# EAGLE design PR9019 (EAGLE 6.6.0)
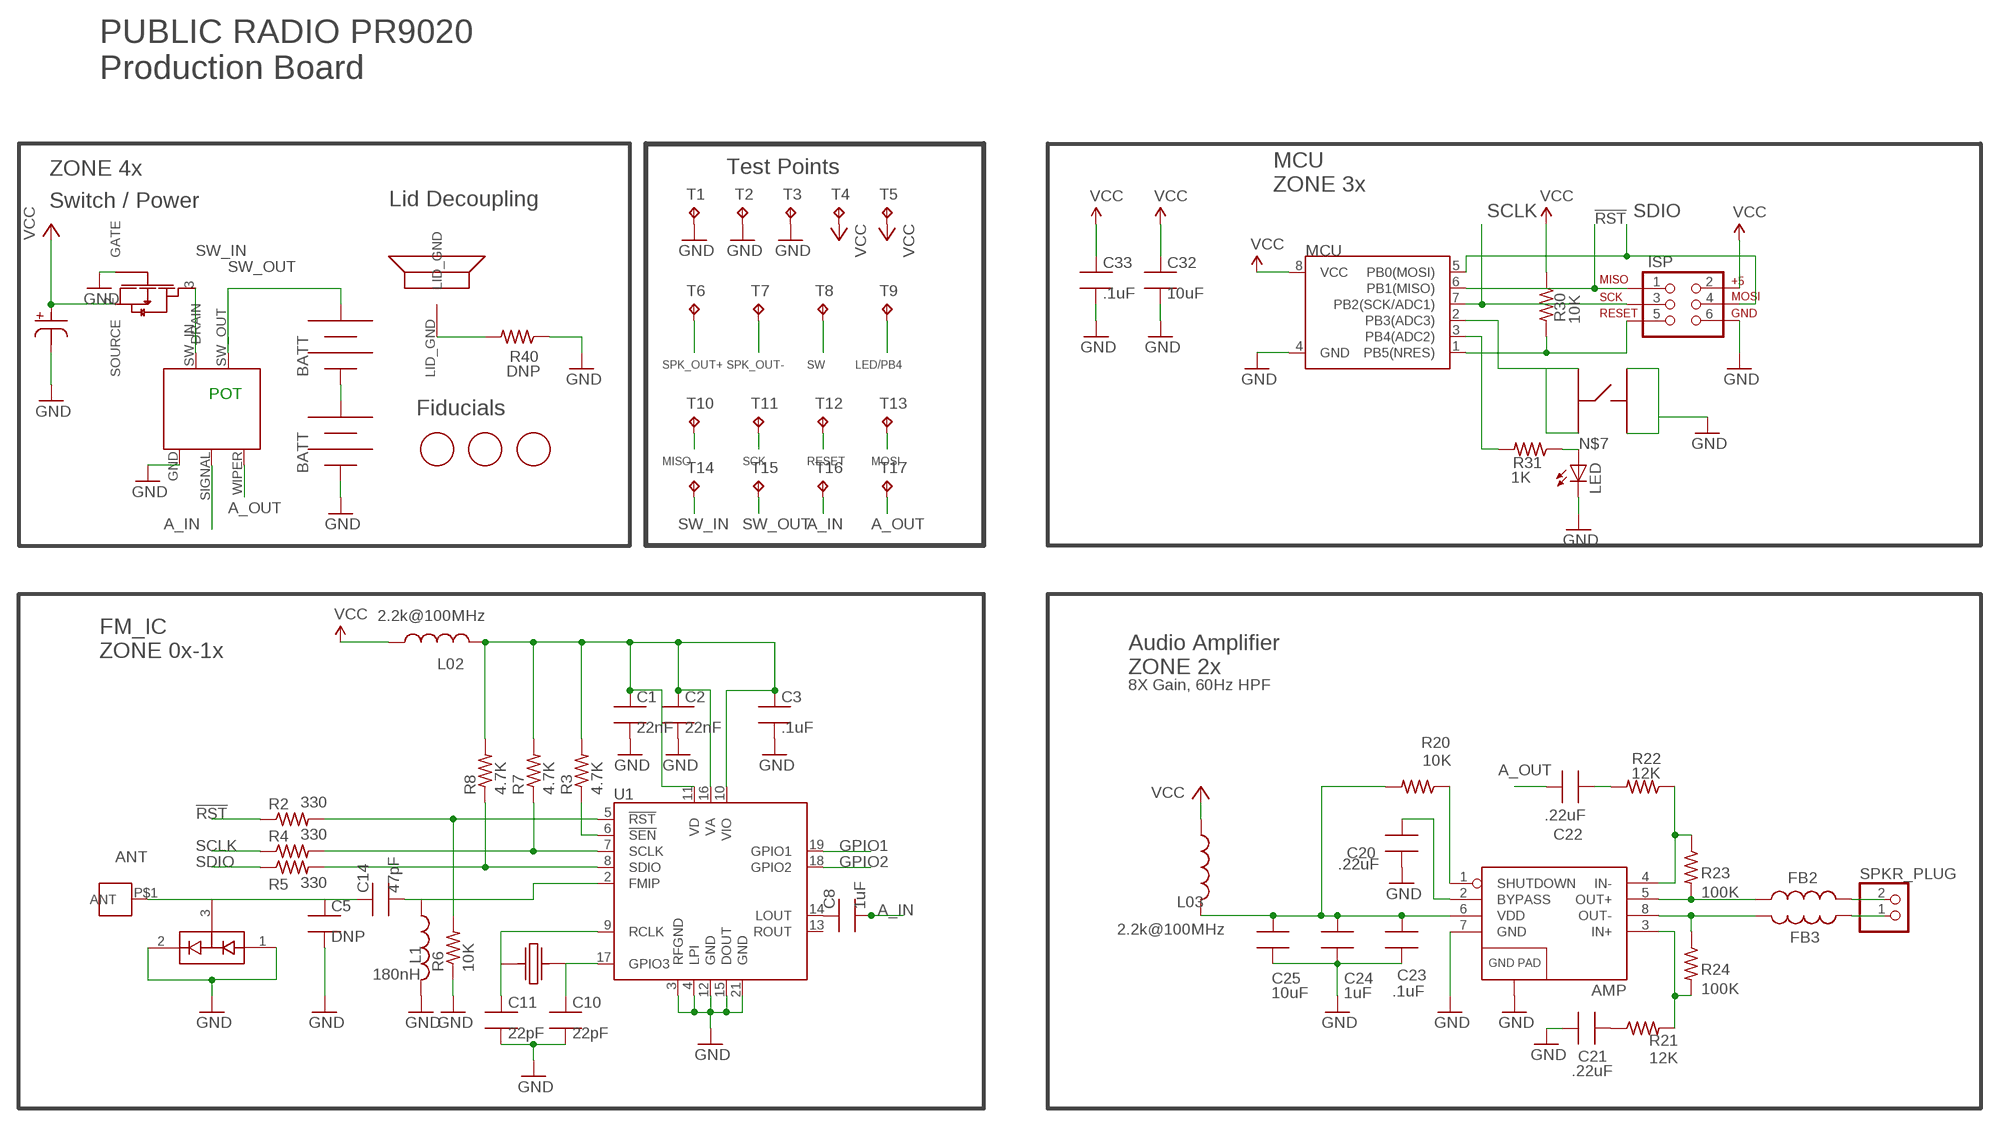
[diagram p0: schematic, sheet 1]

## Parts
AMP  TPA6203A1  [8-MSOP]
ANT_MOUNT  DNP  M3_SCREW_POST  [M3_BOLT_HOLE]
C1  22nF  C_SMT_0603_CPL  [0603_CPL]
C2  22nF  C_SMT_0603_CPL  [0603_CPL]
C3  .1uF  C_SMT_0603_CPL  [0603_CPL]
C5  DNP  C_SMT_0603_CPL  [0603_CPL]
C8  1uF  C_SMT_0603_CPL  [0603_CPL]
C10  22pF  C_SMT_0603_CPL  [0603_CPL]
C11  22pF  C_SMT_0603_CPL  [0603_CPL]
C14  47pF  C_SMT_0603_CPL  [0603_CPL]
C20  .22uF  C_SMT_0603_CPL  [0603_CPL]
C21  .22uF  C_SMT_0603_CPL  [0603_CPL]
C22  .22uF  C_SMT_0603_CPL  [0603_CPL]
C23  .1uF  C_SMT_0603_CPL  [0603_CPL]
C24  1uF  C_SMT_0603_CPL  [0603_CPL]
C25  10uF  C_SMT_0603_CPL  [0603_CPL]
C32  10uF  C_SMT_0603_CPL  [0603_CPL]
C33  .1uF  C_SMT_0603_CPL  [0603_CPL]
C40  220uF  NICHICON_SERIESUD  [NICHICON_UD_63]
D1  BAV99  [SOT23_CPL]
FB2  L_SMT_0805_ADAFRUIT  [0805_ADAFRUIT]
FB3  L_SMT_0805_ADAFRUIT  [0805_ADAFRUIT]
FET1  AO3435  [SOT23_CPL]
ISP  AVR_SPI_PRG_6NS  [2X3-NS]
JP5  BK-92_MPD_AA_BATT_CLIP  [BK92_AA_BATT]
JP6  BK-92_MPD_AA_BATT_CLIP  [BK92_AA_BATT]
L1  180nH  L_SMT_0805_ADAFRUIT  [0805_ADAFRUIT]
L02  2.2k@100MHz  L_SMT_0603_CPL  [0603_CPL]
L03  2.2k@100MHz  L_SMT_0603_CPL  [0603_CPL]
LED  LEDCHIPLED_0805  [CHIPLED_0805]
MARK1  FIDUCIAL  [FIDUCIAL_1MM]
MARK2  FIDUCIAL  [FIDUCIAL_1MM]
MARK3  FIDUCIAL  [FIDUCIAL_1MM]
MCU  ATTINY45TINY45-20-SMT  [8-SOIC]
R1  RV170SF_TAIWANA_POT_SW  [RV170SF_SW_POT]
R2  330  R_SMT_R0603_CPL  [0603_CPL]
R3  4.7K  R_SMT_R0603_CPL  [0603_CPL]
R4  330  R_SMT_R0603_CPL  [0603_CPL]
R5  330  R_SMT_R0603_CPL  [0603_CPL]
R6  10K  R_SMT_R0603_CPL  [0603_CPL]
R7  4.7K  R_SMT_R0603_CPL  [0603_CPL]
R8  4.7K  R_SMT_R0603_CPL  [0603_CPL]
R20  10K  R_SMT_R0603_CPL  [0603_CPL]
R21  12K  R_SMT_R0603_CPL  [0603_CPL]
R22  12K  R_SMT_R0603_CPL  [0603_CPL]
R23  100K  R_SMT_R0603_CPL  [0603_CPL]
R24  100K  R_SMT_R0603_CPL  [0603_CPL]
R30  10K  R_SMT_R0603_CPL  [0603_CPL]
R31  1K  R_SMT_R0603_CPL  [0603_CPL]
R40  DNP  R_SMT_R0603_CPL  [0603_CPL]
SPKR_PLACE  DNP  PR2023_SPKR  [PR2023_SPKR_PLACE]
SPKR_PLUG  JST_2PIN-SMT-RA  [JST-B2B-PH-SM4-TB]
SW1  C&K_PTS645  [C&K_PTS645_SMT]
T1  TPTP20R  [TP20R]
T2  TPTP20R  [TP20R]
T3  TPTP20R  [TP20R]
T4  TPTP20R  [TP20R]
T5  TPTP20R  [TP20R]
T6  TPTP20R  [TP20R]
T7  TPTP20R  [TP20R]
T8  TPTP20R  [TP20R]
T9  TPTP20R  [TP20R]
T10  TPTP20R  [TP20R]
T11  TPTP20R  [TP20R]
T12  TPTP20R  [TP20R]
T13  TPTP20R  [TP20R]
T14  TPTP20R  [TP20R]
T15  TPTP20R  [TP20R]
T16  TPTP20R  [TP20R]
T17  TPTP20R  [TP20R]
U1  SI4702-C19-GMR  [SI470X_20_QFN]
X1  ABS25XTAL  [4-SOJ]

## Nets
3.3V: C1.1 C2.1 C3.1 L02.2 R3.2 R7.2 R8.2 U1.10(VIO) U1.11(VD) U1.16(VA)
!RST: ISP.1 MCU.6(PB1(MISO)) R2.1 T10.TP
!RST-L: R2.2 R6.2 U1.5(!RST)
!SEN-L: R3.1 U1.6(!SEN)
A_IN: C8.2 R1.SIGNAL T16.TP
A_OUT: C22.2 R1.WIPER T17.TP
ANT [antenna]: ANT_MOUNT.P$1(ANT) C5.1 C14.1 D1.3(COM)
GND: AMP.7(GND) AMP.9(GND) C1.2 C2.2 C3.2 C5.2 C10.2 C11.2 C20.1 C21.1 C23.2 C24.2 C25.2 C32.2 C33.2 C40.P$2 D1.1(A1) D1.2(C2) FET1.1(GATE) ISP.6 JP6.NEG JP6.NEG@2(NEG) L1.2 LED.C MCU.4(GND) R1.GND R6.1 R40.1 SW1.P$1 SW1.P$2 T1.TP T2.TP T3.TP U1.3(RFGND) U1.4(LPI) U1.12(GND) U1.15(DOUT) U1.21(GND)
GPIO1: U1.19(GPIO1)
GPIO2: U1.18(GPIO2)
LED/PB4: MCU.3(PB4(ADC2)) R31.2 T9.TP
N$1: C11.1 U1.9(RCLK) X1.P$1
N$2: AMP.6(VDD) C23.1 C24.1 C25.1 L03.2 R20.2
N$3: C22.1 R22.2
N$4: AMP.5(OUT+) FB2.1 R23.2
N$5: AMP.3(IN+) R21.2 R24.2
N$7: LED.A R31.1
N$8: R40.2 SPKR_PLACE.LID_GND
N$9: C8.1 U1.14(LOUT)
N$10: C10.1 U1.17(GPIO3) X1.P$4
N$11: AMP.8(OUT-) FB3.2 R24.1
N$12: AMP.2(BYPASS) C20.2
N$13: JP5.NEG JP5.NEG@2(NEG) JP6.POS JP6.POS@2(POS)
N$14: AMP.4(IN-) R22.1 R23.1
N$16 [antenna]: C14.2 L1.1 U1.2(FMIP)
N$20: AMP.1(SHUTDOWN) R20.1
N$23: C21.2 R21.1
RESET: ISP.5 MCU.1(PB5(NRES)) R30.2 T12.TP
SCLK: ISP.3 MCU.7(PB2(SCK/ADC1)) R4.1 T11.TP
SCLK-L: R4.2 R7.1 U1.7(SCLK)
SDIO: ISP.4 MCU.5(PB0(MOSI)) R5.1 T13.TP
SDIO-L: R5.2 R8.1 U1.8(SDIO)
SPK_OUT+: FB2.2 SPKR_PLUG.2 T6.TP
SPK_OUT-: FB3.1 SPKR_PLUG.1 T7.TP
SW: MCU.2(PB3(ADC3)) SW1.P$3 SW1.P$4 T8.TP
SW_IN: FET1.3(DRAIN) R1.SW_IN T14.TP
SW_OUT: JP5.POS JP5.POS@2(POS) R1.SW_OUT T15.TP
VCC: C32.1 C33.1 C40.P$1 FET1.2(SOURCE) ISP.2 L02.1 L03.1 MCU.8(VCC) R30.1 T4.TP T5.TP
Unconnected: U1.13(ROUT)

## Notes on the sheet
- PUBLIC RADIO PR9020
  Production Board
- ZONE 4x | Test Points
- MCU
  ZONE 3x
- Switch / Power | Lid Decoupling
- POT
- Fiducials
- MISO | SCK | RESET | MOSI
- FM_IC
  ZONE 0x-1x
- Audio Amplifier 
  ZONE 2x
- 8X Gain, 60Hz HPF

## Library data of the parts
AMP = PR_Parts_Library:TPA6203A1: IC AMP AUDIO PWR 1.25W AB 8MSOP; MFG_PN: TPA6203A1DGNR
ANT_MOUNT = PR_Parts_Library:M3_SCREW_POST: Antenna mounting hole for M3 screw.; MFG_PN: DNP
C1 C2 = PR_Parts_Library:C_SMT: SMT capacitor; MFG_PN: CL10B223KB8NNNC; TOL: 10%; VOLTAGE: 16V
C3 C23 C33 = PR_Parts_Library:C_SMT: SMT capacitor; MFG_PN: CL10B104KB8SFNC; TOL: 10%; VOLTAGE: 16V
C5 = PR_Parts_Library:C_SMT: SMT capacitor; MFG_PN: DNP; TOL: 2%; VOLTAGE: 50V
C8 C24 = PR_Parts_Library:C_SMT: SMT capacitor; MFG_PN: CL10B105KP8NNNC; TOL: 10%; VOLTAGE: 10V
C10 C11 = PR_Parts_Library:C_SMT: SMT capacitor; MFG_PN: C1608C0G1H220J080AA; TOL: 5%; VOLTAGE: 50V
C14 = PR_Parts_Library:C_SMT: SMT capacitor; MFG_PN: CL10C470JB8NCNC; TOL: 5%; VOLTAGE: 50V
C20-C22 = PR_Parts_Library:C_SMT: SMT capacitor; MFG_PN: C1608X7R1C224K080AC; TOL: 10%; VOLTAGE: 16V
C25 C32 = PR_Parts_Library:C_SMT: SMT capacitor; MFG_PN: CL10A106MQ8NNNC; TOL: 20%; VOLTAGE: 6.3V
C40 = PR_Parts_Library:NICHICON_SERIESUD: Nichicon UD Series 220uf Cap MFG# UUD1C221MCL1GS; MFG_PN: UUD1C221MCL1GS; TOL: 20%; VOLTAGE: 16V
D1 = PR_Parts_Library:BAV99: DIODE ARRAY GP 100V 215MA SOT23; MFG_PN: BAV99,215
FB2 FB3 = PR_Parts_Library:L_SMT: SMT inductor; CURRENT: 2A; DCR: 45m; MFG_PN: HI0805R800R-10
FET1 = PR_Parts_Library:AO3435: MOSFET P-CH 20V 2.9A SOT23; MFG_PN: AO3435
ISP = PR_Parts_Library:AVR_SPI_PRG_6: DIL VERTICAL PC TAIL PIN HEADER; MFG_PN: M20-9980346
JP5 JP6 = PR_Parts_Library:BK-92_MPD_AA_BATT_CLIP: Thru hole AA battery clip pair.; MFG_PN: 2 of BK92 - supplied by CL Labs
L1 = PR_Parts_Library:L_SMT: SMT inductor; CURRENT: 400mA; DCR: 640m; MFG_PN: AISC-0805-R18J-T; TOL: 5%
L02 L03 = PR_Parts_Library:L_SMT: SMT inductor; CURRENT: 150mA; DCR: 2.3; MFG_PN: HZ0603A222R-10
LED = adafruit:LED: LED OSRAM: - CHIPLED LG R971, LG N971, LY N971, LG Q971, LY Q971, LO R971, LY R971 LH N974, LH R974 LS Q976, LO Q976, LY Q976 LO Q996 - Hyper CHIPLED LW Q18S LB Q993, LB Q99A, LB R99A - SideLED LS A670, LO A670, LY A670, LG A670, LP A670 LB A673, LV A673, LT A673, LW A673 LH A674 LY A675 LS A676, LA A676, LO A676, LY A676, LW A676 LS A679, LY A679, LG A679 - Hyper Micro SIDELED® LS Y876, LA Y876, LO Y876, LY Y876 LT Y87S - SmartLED LW L88C, LW L88S LB L89C, LB L89S, LG L890 LS L89K, LO L89K, LY L89K LS L896, LA L896, LO L896, LY L896 - TOPLED LS T670, LO T670, LY T670, LG T670, LP T670 LSG T670, LSP T670, LSY T670, LOP T670, LYG T670 LG T671, LOG T671, LSG T671 LB T673, LV T673, LT T673, LW T673 LH T674 LS T676, LA T676, LO T676, LY T676, LB T676, LH T676, LSB T676, LW T676 LB T67C, LV T67C, LT T67C, LS T67K, LO T67K, LY T67K, LW E67C LS E67B, LA E67B, LO E67B, LY E67B, LB E67C, LV E67C, LT E67C LW T67C LS T679, LY T679, LG T679 LS T770, LO T770, LY T770, LG T770, LP T770 LB T773, LV T773, LT T773, LW T773 LH T774 LS E675, LA E675, LY E675, LS T675 LS T776, LA T776, LO T776, LY T776, LB T776 LHGB T686 LT T68C, LB T68C - Hyper Mini TOPLED® LB M676 - Mini TOPLED Santana® LG M470 LS M47K, LO M47K, LY M47K Source: http://www.osram.convergy.de/; MFG_PN: LY R976-PS-36
MARK1-MARK3 = PR_Parts_Library:FIDUCIAL: 1mm fiducial.; MFG_PN: DNP
MCU = PR_Parts_Library:ATTINY45: Atmel 8-pin 2/4/8kB flash uC; MFG_PN: ATTINY45-20SUR
R1 = PR_Parts_Library:RV170SF_TAIWANA_POT_SW: Thru hole switched potentiometer.; MFG_PN: RV170SF-43-20F-A10K - supplied by CL Labs
R2 R4 R5 = PR_Parts_Library:R_SMT: SMT resistor; MFG_PN: MCR03ERTJ331; POWER: 1/10W; TOL: 5%
R3 R7 R8 = PR_Parts_Library:R_SMT: SMT resistor; MFG_PN: ERJ-3EKF4701V; POWER: 1/10W; TOL: 1%
R6 R20 R30 = PR_Parts_Library:R_SMT: SMT resistor; MFG_PN: ERJ-3GEYJ103V; POWER: 1/10W; TOL: 5%
R21 R22 = PR_Parts_Library:R_SMT: SMT resistor; MFG_PN: RC0603FR-0712KL; POWER: 1/10W; TOL: 1%
R23 R24 = PR_Parts_Library:R_SMT: SMT resistor; MFG_PN: ERJ-3EKF1003V; POWER: 1/10W; TOL: 1%
R31 = PR_Parts_Library:R_SMT: SMT resistor; MFG_PN: ERJ-3EKF1001V; POWER: 1/10W; TOL: 1%
R40 = PR_Parts_Library:R_SMT: SMT resistor; MFG_PN: ERJ-3GEY0R00V
SPKR_PLACE = PR_Parts_Library:PR2023_SPKR: Speaker placement for PR2023.; MFG_PN: DNP
SPKR_PLUG = PR_Parts_Library:JST_2PIN: JST 2-pin connector; MFG_PN: B2B-PH-SM4-TB(LF)(SN)
SW1 = PR_Parts_Library:C&K_PTS645: SWITCH TACTILE SPST-NO 0.05A 12V; MFG_PN: PTS645SM43SMTR92 LFS
T1-T17 = PR_Parts_Library:TP: Test pad; MFG_PN: DNP
U1 = PR_Parts_Library:SI4702-C19-GMR: IC FM RADIO TUNER 20-QFN; MFG_PN: Si4702 C19 GM - supplied by CL Labs
X1 = PR_Parts_Library:ABS25XTAL: 4PIN 32.768 Xtal MFG# ABS25-32.768KHZ-T; MFG_PN: ABS25-32.768KHZ-T

## Net classes
1 antenna: clearance 1.27 mm

## Board
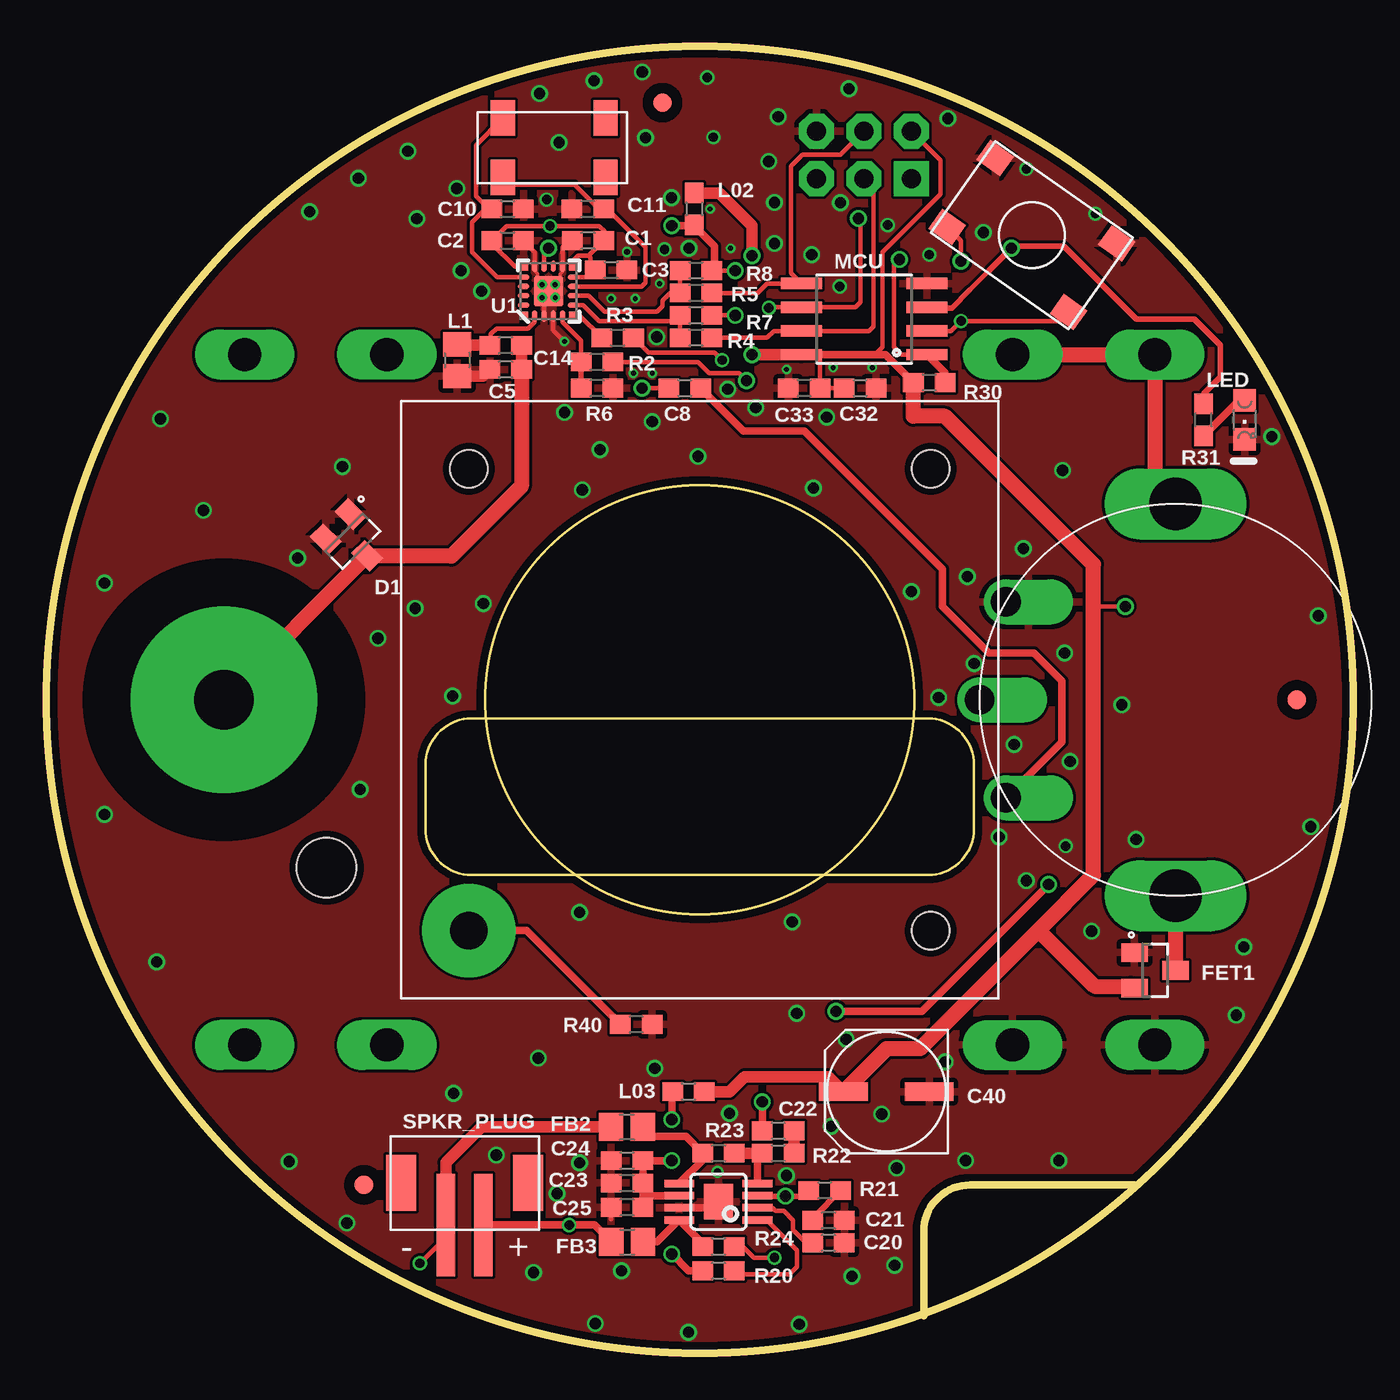
[diagram p1: board, top side]
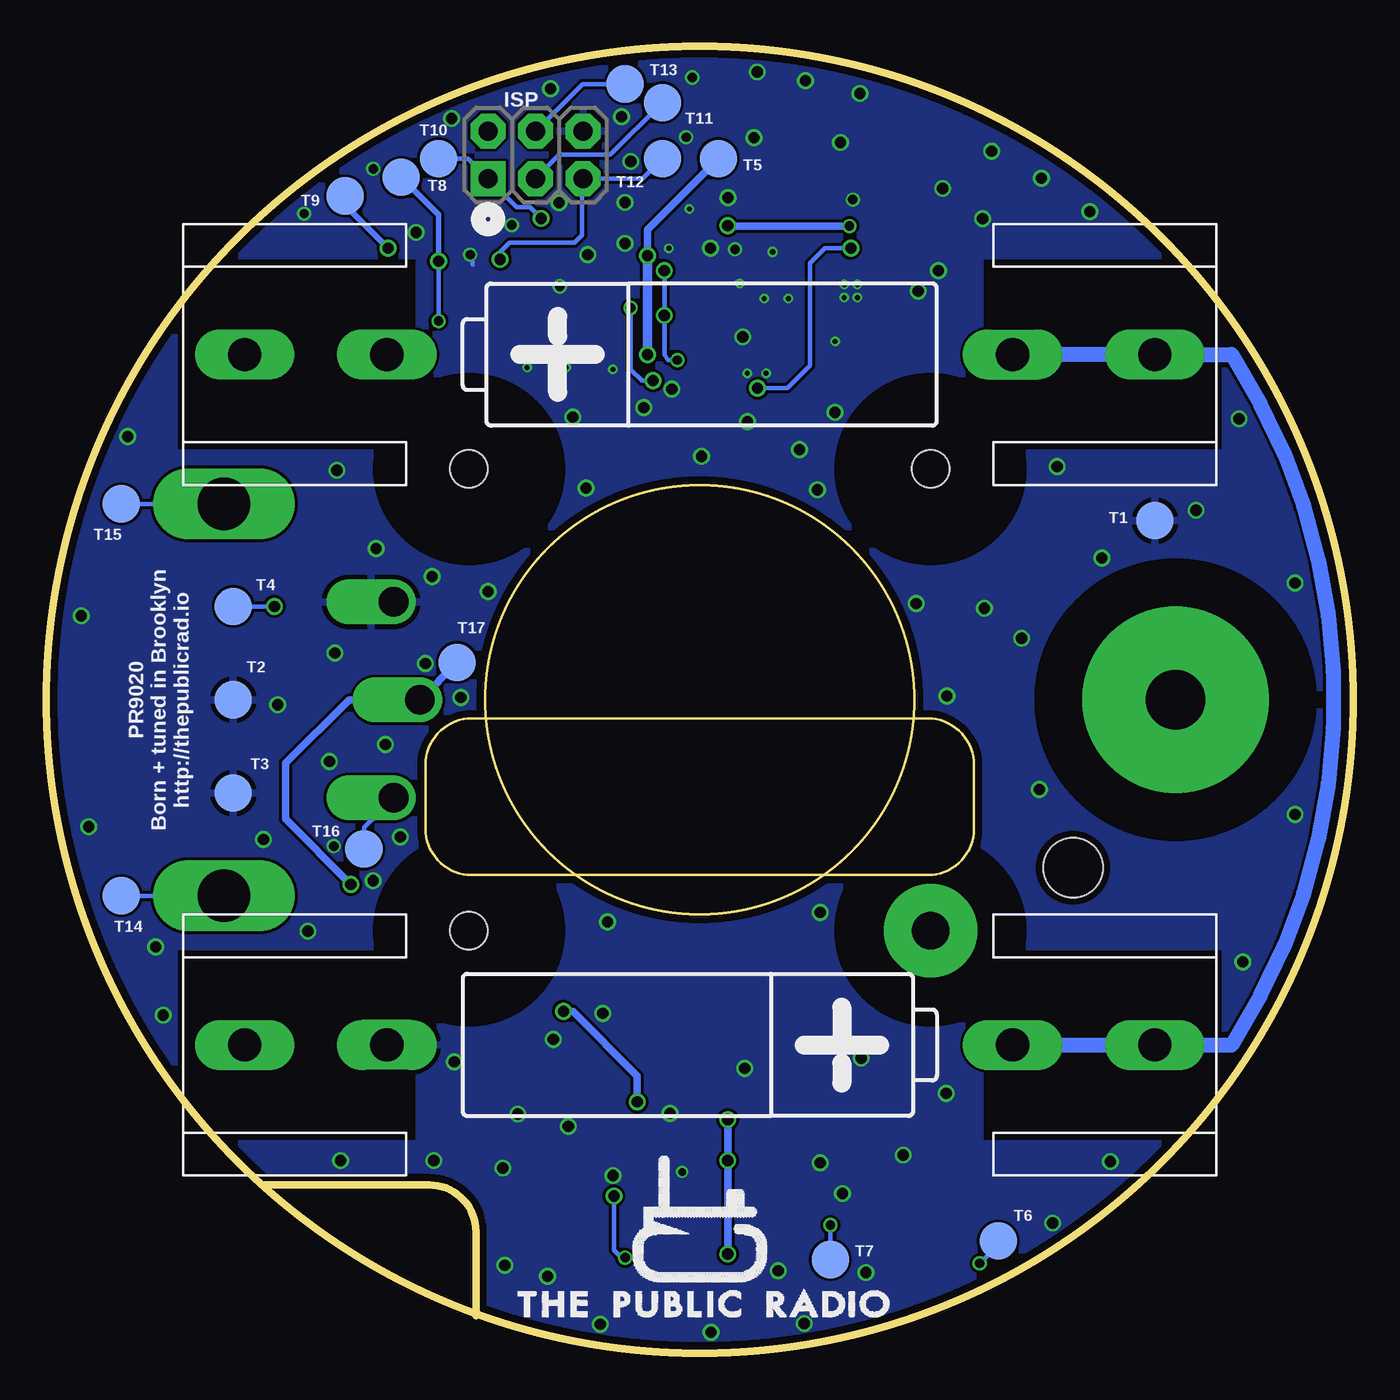
[diagram p2: board, bottom side, seen from below]

Size 70 x 70 mm. Coordinates in mm from the lower left corner, seen from the top.
Outline: 47,2 47,6.5 arc-90 49.5,9 58.3,9
Outline: circle at 35,35 radius 35
Copper layers (1*16): Top 0.0356mm / dielectric 1.5011mm / Bottom 0.0356mm
Design rules "LaenPCBOrder *": minimum track width 6mil, minimum drill 13mil, track to track 6mil, track to pad 6mil, pad to pad 6mil, via to via 6mil, smd to smd 6mil, copper to edge 15mil, drill to drill 6mil, minimum pad ring 7mil, minimum via ring 5mil, stop-mask expansion 3mil, vias tented up to drill 0mil, thermal gap 10mil
Holes 3.2 mm at 15,26
tRestrict: area 26.1,56.1 to 27.7,57.7; 8 lines

### Footprints (pad centres in the part's own frame; a part is rotated, then mirrored left to right if it is on the bottom)
8-MSOP = smd 0.4 x 1.6: 1 -0.975,-2.1; 2 -0.325,-2.1; 3 0.325,-2.1; 4 0.975,-2.1; 5 0.975,2.1; 6 0.325,2.1; 7 -0.325,2.1; 8 -0.975,2.1 | smd 1.89 x 1.57: 9 0,0
M3_BOLT_HOLE = drill 3.2 pad 10: P$1 0,0
0603_CPL = smd 1.1 x 1: 1 -0.85,0; 2 0.85,0
NICHICON_UD_63 = smd 1 x 2.6: P$1 0,2.3; P$2 0,-2.3
SOT23_CPL = smd 1.4 x 1: 1 -1.1,0.95; 2 -1.1,-0.95; 3 1.1,0
0805_ADAFRUIT = smd 1.3 x 1.5: 1 -0.85,0; 2 0.85,0
2X3-NS = drill 1.016 pad 1.88 square: 1 -2.54,-1.27 | drill 1.016 pad 1.88 octagon: 2 -2.54,1.27; 3 0,-1.27; 4 0,1.27; 5 2.54,-1.27; 6 2.54,1.27
BK92_AA_BATT = drill 1.778 long: NEG -24.384,0; NEG@2 -16.764,0; POS 16.764,0; POS@2 24.384,0
CHIPLED_0805 = smd 1.2 x 1.2: A 0,-1.05; C 0,1.05
FIDUCIAL_1MM = smd 1 x 1: 1 0,0
8-SOIC = smd 0.61 x 2.21: 1 -1.905,-3.378; 2 -0.635,-3.378; 3 0.635,-3.378; 4 1.905,-3.378; 5 1.905,3.353; 6 0.635,3.353; 7 -0.635,3.353; 8 -1.905,3.353
RV170SF_SW_POT = drill 1.6 offset: GND -5.25,-9.09; SIGNAL 5.25,-9.09; WIPER 0,-10.5 | drill 2.8 long: SW_IN 10.5,0; SW_OUT -10.5,0
PR2023_SPKR_PLACE = drill 2 pad 5: LID_GND -12.37,-12.37 | hole 2: -12.37,12.37; 12.37,12.37; 12.37,-12.37
JST-B2B-PH-SM4-TB = smd 1 x 5.5: 1 1,-2.75; 2 -1,-2.75 | smd 1.6 x 3: NC1 -3.4,-0.5; NC2 3.4,-0.5
C&K_PTS645_SMT = smd 1.55 x 1.3: P$1 -3.975,2.25; P$2 3.975,2.25; P$3 -3.975,-2.25; P$4 3.975,-2.25
TP20R = smd 2 x 2: TP 0,0
SI470X_20_QFN = smd 0.34 x 0.34: 1 -1.275,1.265; 6 -1.265,-1.265; 11 1.265,-1.265; 16 1.265,1.265 | smd 0.61 x 0.28: 2 -1.335,0.75; 3 -1.335,0.25; 4 -1.335,-0.25; 5 -1.335,-0.75; 12 1.335,-0.75; 13 1.335,-0.25; 14 1.335,0.25; 15 1.335,0.75 | smd 0.28 x 0.61: 7 -0.75,-1.335; 8 -0.25,-1.335; 9 0.25,-1.335; 10 0.75,-1.335; 17 0.75,1.335; 18 0.25,1.335; 19 -0.25,1.335; 20 -0.75,1.335 | smd 1.6 x 1.6: 21 0,0
4-SOJ = smd 1.3 x 1.9: P$1 -2.75,-1.6; P$2 2.75,-1.6; P$3 2.75,1.6; P$4 -2.75,1.6

### Placement (x,y rotation side)
AMP  36,8.1 90 top
ANT_MOUNT  9.5,35 0 top
C1  29.01,59.6 180 top
C2  24.7,59.6 0 top
C3  30.24,58.03 0 top
C5  24.6,52.7 180 top
C8  34.2,51.7 0 top
C10  24.7,61.3 0 top
C11  29,61.3 180 top
C14  24.6,54 180 top
C20  41.9,5.9 180 top
C21  41.9,7.1 180 top
C22  39.2,11.9 180 top
C23  31.1,9.1 180 top
C24  31.1,10.3 180 top
C25  31.1,7.8 180 top
C32  43.6,51.7 0 top
C33  40.6,51.7 180 top
C40  45,14 90 top
D1  16.4,43.5 315 top
FB2  31.1,12.1 180 top
FB3  31.11,5.94 0 top
FET1  59.4,20.5 0 top
ISP  43.8,64.2 0 bottom
JP5  35,53.5 180 bottom
JP6  35,16.5 0 bottom
L1  22,53.2 270 top
L02  34.7,61.3 270 top
L03  34.4,14 180 top
LED  64.2,50 180 top
MARK1  17,9 0 top
MARK2  33,67 0 top
MARK3  67,35 0 top
MCU  43.8,55.4 90 top
R1  60.5,35 270 top
R2  29.5,53.1 180 top
R3  30.6,54.4 0 top
R4  34.8,54.4 180 top
R5  34.8,56.8 180 top
R6  29.5,51.7 180 top
R7  34.8,55.6 0 top
R8  34.8,58 0 top
R20  36,4.4 180 top
R21  41.7,8.7 180 top
R22  39.2,10.7 0 top
R23  36,10.7 180 top
R24  36,5.7 0 top
R30  47.3,52 0 top
R31  62,50 90 top
R40  31.6,17.6 180 top
SPKR_PLACE  35,35 0 top
SPKR_PLUG  22.4,9.6 0 top
SW1  52.8,59.9 325 top
T1  10.6,44.6 0 bottom
T2  60,35 0 bottom
T3  60,30 0 bottom
T4  60,40 0 bottom
T5  34,64 0 bottom
T6  19,6 0 bottom
T7  28,5 0 bottom
T8  51,63 0 bottom
T9  54,62 0 bottom
T10  49,64 0 bottom
T11  37,67 0 bottom
T12  37,64 0 bottom
T13  39,68 0 bottom
T14  66,24.5 0 bottom
T15  66,45.5 0 bottom
T16  53,27 0 bottom
T17  48,37 0 bottom
U1  26.9,56.9 90 top
U$1  [PR_LOGO]  35,7.5 0 bottom
X1  27.2,64.58 0 top

### Tracks (layer width: path | path; a pad name or v marks a point on that pad's centre or on a via)
3.3V  (via drill 0.5, 0.6)
  Top 0.254: R7.2 v36.9,55.6 | 25.23,58.16 U1.16 25.6,58.2 25.1,58.2 23.85,59.45 C2.1 24.64,60.39 v26.98,60.39 29.61,60.39 29.9,60.1 29.9,59.64 C1.1 | v36.2,53.2 35.8,53.6 32.25,53.6 R3.2 | U1.10 28.35,57.65 | R8.2 v36.9,58 | U1.11 28.16,58.48 28.47,58.79 29.05,58.79 | 29.05,58.79 C1.1 | 29.8,59.66 C1.1 | U1.10 29.07,57.65 C3.1 | U1.10 28.93,57.65 29.16,57.88 29.16,58.68 29.05,58.79
  Top 0.406: 34.7,60.4 35.8,59.3 35.8,58.05 | v33.5,60.4 34.65,60.4 L02.2
  Top 0.61: L02.2 34.7,60.4 | 35.8,58.05 R8.2
  Bottom 0.254: v36.9,58 v36.9,55.6 36.9,53.5 36.7,53.2 v36.2,53.2
  Bottom 0.406: v26.98,60.39 v33.49,60.39 v33.5,60.4
!RST  (via drill 0.5, 0.6)
  Top 0.254: 41,56.03 MCU.6 38.73,56.03 v38.7,56 | 41,56.03 43.34,56.03 43.6,56.3 43.6,60.7 v43.5,60.8 | 40.97,56 41,56.03 | R2.1 34.9,53.1 35.5,52.5 37.1,52.5 v37.5,52.1
  Bottom 0.254: T10.TP 47.41,64 ISP.1 44.81,61.4 44.1,61.4 v43.5,60.8 | v38.7,56 38.7,52.7 38.1,52.1 v37.5,52.1
!RST-L
  Top 0.254: U1.5 27.65,55.25 28.65,54.25 R2.2
  Top 0.305: R6.2 R2.2
!SEN-L
  Top 0.254: R3.1 28.52,55.63 U1.6
A_IN
  Top 0.406: R1.SIGNAL 54.4,32.74 54.4,36 52.9,37.5 50.5,37.5 48,40 48,42 40.6,49.4 37.35,49.4 C8.2
  Bottom 0.254: T16.TP 53,28.16 R1.SIGNAL
A_OUT  (via drill 0.6)
  Top 0.406: C22.2 v38.35,13.45 | v53.7,25.1 46.9,18.3 v42.3,18.3
  Bottom 0.305: 42.1,18.3 v42.3,18.3
  Bottom 0.406: v53.7,25.1 57.2,28.6 57.2,31.6 53.8,35 R1.WIPER T17.TP | v38.35,13.45 38.35,14.85 41.8,18.3 v42.3,18.3
ANT
  Top 0.61: C14.1 C5.1
  Top 0.813: ANT_MOUNT.P$1 9.5,35.04 D1.3 17.2,42.7 21.7,42.7 25.45,46.45 C5.1
GND  (via drill 0.25, 0.25 pad 0.1, 0.3, 0.4, 0.5, 0.6)
  Top 0.2: U1.12 27.65,57.95 27.5,57.8 27.5,57.5 v27.25,57.25 | 26.34,57.46 v26.55,57.25 26.31,57.49 26.31,57.84 26.15,58 U1.15 | 27.15,56.44 v27.26,56.55
  Top 0.254: v27.25,57.25 U1.21 | v26.55,57.25 v26.55,57.24 26.57,57.23 | U1.15 26.15,59 C2.2 | U1.12 27.65,59.25 28,59.6 C1.2 | U1.4 27.15,54.8 v27.75,54.2 | U1.3 26.65,56.45 v26.55,56.55 | 30.25,7.15 C25.2
  Top 0.305: AMP.7 35.67,7.78 AMP.9
  Top 0.406: AMP.7 36.08,7.78 36.1,7.8
  Top 0.61: L1.2 23.4,52.35 C5.2
  Bottom 0.254: 47.18,58.84 47.18,58.33
  other vias: 35.4,68.35 32.45,49.9 65.65,49.1 28.7,46.25 26.41,67.49 52.5,25.3 46.35,40.8 43.15,4.1 16.09,6.96 21.8,13.9 28.55,23.6 39.95,23.1 64.15,21.75 51.85,32.6 19.36,64.39 47.3,58.85 43,67.75 48.3,66.15 41.1,46.35 40.33,1.53 26.35,15.8 44.75,12.8 41.8,50.15 56,22.6 56.2,61.05 39,59.45 49.7,36.95 23.3,56.9 42.54,61.64 42.5,57.15 35.73,65.15 39,61.65 21.98,62.4 19.84,60.78 36.5,51.65 50.2,60.04 14.1,61.15 6.1,50.05 3.1,41.25 3.1,28.85 13,10.25 29.4,1.57 49.25,10.3 54.25,10.3 63.75,18.1 67.75,28.2 68.15,39.5 29.65,48.4 27.75,50.4 19.75,39.9 23.4,40.15 21.75,35.2 34.9,48.05 16.7,62.95 16.8,30.2 5.9,20.95 22.21,58 38,50.65 17.75,38.3 13.45,42.6 15.85,47.5 34.4,1.1 32.1,65.12 27.46,64.87 26.8,61.81 31.1,59 33.49,61.91 34.42,59.2 32.7,54.45 36.6,12.84 32.59,15.25 40.2,18.2 42.85,16.8 47.8,35.12 52.35,43.1 54.55,37.5 54.85,31.7 54.45,47.3 39.2,66.25 38.7,63.85 8.4,45.15 30.25,56.5 31.55,56.5 32.85,57.3 36.65,59.2 35.55,61.3 32.45,52.5 39.65,9.5 26.1,4.3 27.36,8.54 28.55,10.18 24.1,10.6 42.04,12.14 48.15,15.6 45.45,4.7 45.55,9.9 31.45,52.5 39.65,52.7 42.15,52.8 44.25,52.8 41,58.85 52.5,63.45 33.11,59.14 30.8,4.4 35.95,9.7 29.34,68.17 31.92,68.64 51.04,27.65 54.61,27.16 58.38,27.52 57.62,34.73 49.34,41.61 45.07,60.44
  pour Bottom: 0,35 arc90 35,0 arc90 70,35 arc90 35,70 arc90
  pour Top: 0,35 arc90 35,0 arc90 70,35 arc90 35,70 arc90
LED/PB4  (via drill 0.6)
  Top 0.254: 50.5,58 49.45,56.95 | 47.34,56.2 MCU.3
  Top 0.305: 50.5,58 v51.7,59.2 51.8,59.3 54.5,59.3 58.4,55.4 61.5,55.4 62.9,54 62.9,52.3 62,51.4 R31.2 | 49.45,56.95 48.5,56 47.21,56 MCU.3
  Bottom 0.305: T9.TP 54,61.5 v51.7,59.2
N$1
  Top 0.254: X1.P$1 24.75,62.6 28.3,62.6 29.6,61.3 C11.1 | C11.1 29.7,61.3 | C11.1 30.05,61.3 32.1,59.25 32.1,57.36 31.89,57.15 U1.9
N$2  (via drill 0.6)
  Top 0.406: 31.95,8.43 C23.1 C24.1 v33.5,10.3 | 31.95,8.43 C25.1 | AMP.6 31.95,8.43 | v33.5,12.5 33.5,13.75 L03.2 | R20.2 34.4,4.4 v33.5,5.3
  Bottom 0.406: v33.5,5.3 v33.5,10.3 v33.5,12.5
N$3
  Top 0.61: R22.2 C22.1
N$4
  Top 0.406: AMP.5 35.15,10.32 R23.2 34.25,11.6 32.4,11.6 31.95,12.05 FB2.1
N$5  (via drill 0.5, 0.6)
  Top 0.254: R24.2 37.3,5.7 37.9,5.1 v39,5.1
  Top 0.305: AMP.3 38.12,8.4 v39.6,8.4 40.55,8.4 R21.2
  Bottom 0.254: v39,5.1 39.2,5.1 39.6,5.5 v39.6,8.4
N$7
  Top 0.406: R31.1 63.89,51.04 LED.A
N$8
  Top 0.406: SPKR_PLACE.LID_GND 25.72,22.63 R40.2
N$9  (via drill 0.6)
  Top 0.254: U1.14 26.65,58.95 v26.9,59.2 | v31.9,51.7 C8.1
  Bottom 0.254: v31.9,51.7 30.3,51.7 29.1,52.9 29.1,58.4 28.3,59.2 v26.9,59.2
N$10
  Top 0.254: U1.17 24.15,57.65 22.8,59 22.8,60.6 23.5,61.3 C10.1 | C10.1 23.8,61.2 | X1.P$4 23,64.73 23,62 23.7,61.3 C10.1
N$11
  Top 0.406: R24.1 35.15,5.88 AMP.8 32.72,5.94 FB3.2
N$12
  Top 0.254: 40.7,5.9 40,6.6 40,7.1 39.5,7.6 39.07,7.6 38.9,7.78 AMP.2 38.17,7.7
  Top 0.305: 40.7,5.9 C20.2
N$13
  Bottom 0.813: JP6.POS JP6.POS@2 6.5,16.5 arc-66 6.5,53.5 JP5.NEG JP5.NEG@2
N$14
  Top 0.406: AMP.4 38.1,10.45 R22.1
  Top 0.61: R22.1 R23.1
N$16
  Top 0.254: U1.2 26.15,55.25 25.8,54.9 24.1,54.9 23.8,54.6 23.8,54.05 C14.2
  Top 0.61: C14.2 22.05,54 L1.1
N$20
  Top 0.254: AMP.1 38.12,7.1 38.6,7.1 40.2,5.5 40.2,4.6 39.8,4.2 37.05,4.2 R20.1
N$21
  pour Bottom: 
N$23
  Top 0.305: R21.1 41.12,7.27 arc45 C21.2
RESET  (via drill 0.6)
  Top 0.254: MCU.1 45.8,53.49 45.4,53.9 45.4,58.3 v45.7,58.6
  Top 0.406: R30.2 48.15,52.52 MCU.1
  Bottom 0.254: v45.7,58.6 45.7,59 45.2,59.5 41.7,59.5 41.3,59.9 41.3,62.89 ISP.5 38.07,62.93 T12.TP
SCLK
  Top 0.254: MCU.7 44.06,54.77 44.3,55 44.3,62.43 ISP.3 | 40.38,54.7 MCU.7 | MCU.7 38.97,54.77 38.6,54.4 R4.1
  Bottom 0.254: ISP.3 42.53,64.2 39.8,64.2 T11.TP
SCLK-L
  Top 0.254: R4.2 R7.1 33.65,55.3 29.6,55.3 28.75,56.15 U1.7
SDIO
  Top 0.254: ISP.4 42.53,64.2 40.5,64.2 39.9,63.6 39.9,57.85 MCU.5 38.6,57.3 38.1,56.8 R5.1
  Bottom 0.254: T13.TP 41.27,68 ISP.4
SDIO-L
  Top 0.254: R5.2 R8.1 | 33.85,57 R5.2 | R5.2 33.4,56.8 33,56.4 33,56.1 32.7,55.8 29.9,55.8 29.05,56.65 U1.8
SPK_OUT+  (via drill 0.5)
  Top 0.254: v20,4.8 21.4,6.2 SPKR_PLUG.2
  Top 0.61: FB2.2 23.3,12.1 21.4,10.2 SPKR_PLUG.2
  Bottom 0.254: T6.TP 19,5.8 v20,4.8
SPK_OUT-  (via drill 0.5)
  Top 0.406: FB3.1 29.35,6.85 v28,6.85 SPKR_PLUG.1
  Bottom 0.254: v28,6.85 T7.TP
SW  (via drill 0.5, 0.6)
  Top 0.254: MCU.2 48.47,54.77 v49,55.3 54.29,55.3 SW1.P$4 | v49,58.5 49,59.59 SW1.P$3
  Bottom 0.254: v49,55.3 v49,58.5
  Bottom 0.305: v49,58.5 49,61 T8.TP
SW_IN
  Top 0.813: FET1.3 R1.SW_IN
  Bottom 0.254: T14.TP R1.SW_IN
SW_OUT
  Top 0.813: JP5.POS JP5.POS@2 59.38,46.62 R1.SW_OUT
  Bottom 0.254: T15.TP R1.SW_OUT
VCC  (via drill 0.6)
  Top 0.254: ISP.2 47.9,63.91 47.9,62.1 44.8,59 44.8,53.9 44.4,53.49 41.4,53.49 41.45,53.45 C33.1 C32.1 | v57.8,40 56.1,40
  Top 0.406: R30.1 44.95,53.49 41.4,53.49 MCU.8
  Top 0.61: MCU.8 v37.8,53.49 | L02.1 36.05,62.15 37.8,60.4 v37.8,58.8 | C40.P$1 41.9,14.8 37.4,14.8 36.6,14 L03.1
  Top 0.813: 53.15,22.65 46.8,16.3 45,16.3 C40.P$1 | 53.15,22.65 56.1,25.6 56.1,40 56.1,42.25 48.15,50.2 46.45,50.2 R30.1 | 53.15,22.65 56.15,19.65 58.1,19.65 FET1.2
  Bottom 0.254: T4.TP v57.8,40
  Bottom 0.406: T5.TP 37.8,60.2 v37.8,58.8
  Bottom 0.5: v37.8,53.5 v37.8,58.8
  Bottom 0.61: v37.8,53.49 v37.8,53.5

### Text on the board
bNames: PR9020 / Born + tuned in Brooklyn / http://thepublicrad.io